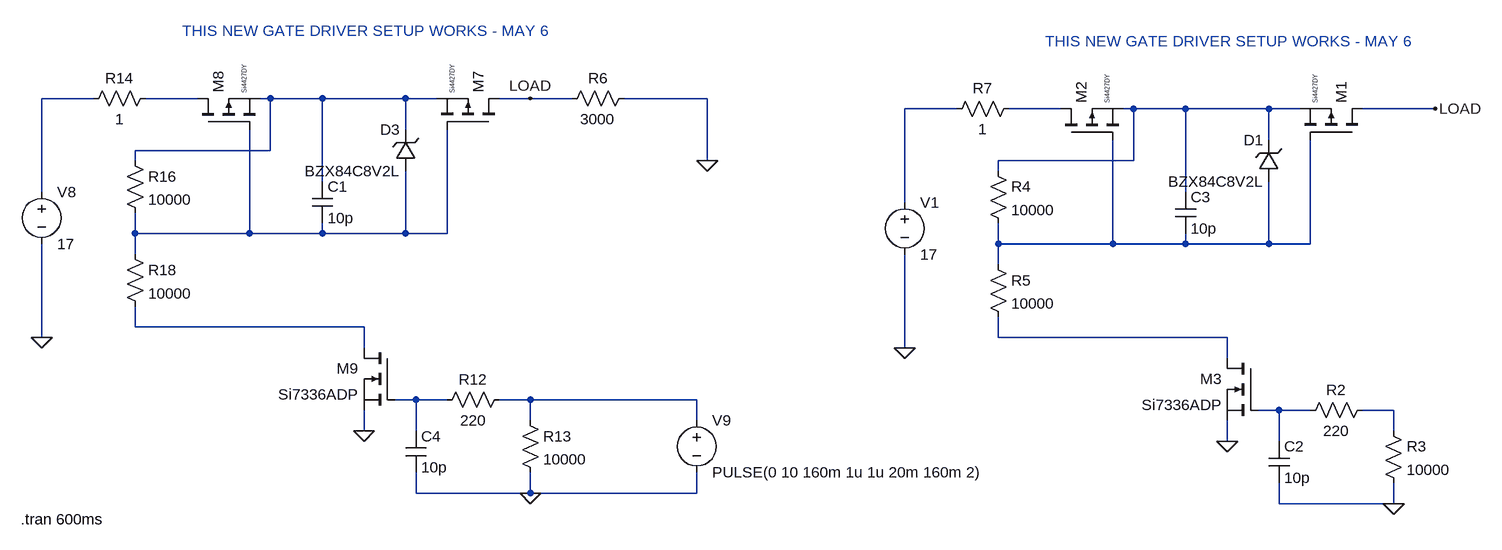
[diagram p0: schematic PMOS Bidirectional Switch OLD.asc]
PMOS Bidirectional Switch OLD.asc, the LTspice schematic file:
Version 4.1
SHEET 1 1960 2516
WIRE -768 400 -848 400
WIRE -608 400 -688 400
WIRE -496 400 -512 400
WIRE -416 400 -496 400
WIRE -288 400 -416 400
WIRE -240 400 -288 400
WIRE -96 400 -144 400
WIRE -32 400 -96 400
WIRE 176 400 48 400
WIRE 560 416 480 416
WIRE 720 416 640 416
WIRE 832 416 816 416
WIRE 912 416 832 416
WIRE 1040 416 912 416
WIRE 1088 416 1040 416
WIRE 1296 416 1184 416
WIRE -288 448 -288 400
WIRE 1040 464 1040 416
WIRE -496 480 -496 400
WIRE -496 480 -704 480
WIRE -704 496 -704 480
WIRE 176 496 176 400
WIRE 832 496 832 416
WIRE 832 496 624 496
WIRE 624 512 624 496
WIRE -416 528 -416 400
WIRE -848 544 -848 400
WIRE 912 544 912 416
WIRE 480 560 480 416
WIRE -704 608 -704 576
WIRE -528 608 -528 448
WIRE -528 608 -704 608
WIRE -416 608 -416 592
WIRE -416 608 -528 608
WIRE -288 608 -288 512
WIRE -288 608 -416 608
WIRE -224 608 -224 448
WIRE -224 608 -288 608
WIRE 624 624 624 592
WIRE 800 624 800 464
WIRE 800 624 624 624
WIRE 912 624 912 608
WIRE 912 624 800 624
WIRE 1040 624 1040 528
WIRE 1040 624 912 624
WIRE 1104 624 1104 464
WIRE 1104 624 1040 624
WIRE -704 640 -704 608
WIRE 624 656 624 624
WIRE -704 752 -704 720
WIRE -352 752 -704 752
WIRE -848 768 -848 624
WIRE 624 768 624 736
WIRE 976 768 624 768
WIRE -352 784 -352 752
WIRE 480 784 480 640
WIRE 976 800 976 768
WIRE -272 864 -304 864
WIRE -224 864 -272 864
WIRE -96 864 -144 864
WIRE 160 864 -96 864
WIRE 1056 880 1024 880
WIRE 1104 880 1056 880
WIRE 1232 880 1184 880
WIRE -96 896 -96 864
WIRE 160 896 160 864
WIRE -352 912 -352 880
WIRE -272 912 -272 864
WIRE 1232 912 1232 880
WIRE 976 928 976 896
WIRE 1056 928 1056 880
WIRE -272 1008 -272 976
WIRE -96 1008 -96 976
WIRE -96 1008 -272 1008
WIRE 160 1008 160 976
WIRE 160 1008 -96 1008
WIRE 1056 1024 1056 992
WIRE 1232 1024 1232 992
WIRE 1232 1024 1056 1024
FLAG 176 496 0
FLAG -848 768 0
FLAG -352 912 0
FLAG -96 1008 0
FLAG 480 784 0
FLAG 976 928 0
FLAG 1232 1024 0
FLAG 1296 416 LOAD
FLAG -96 400 LOAD
SYMBOL pmos -144 448 M270
WINDOW 3 56 72 Left 0
SYMATTR Value Si4427DY
SYMATTR InstName M7
SYMBOL pmos -608 448 R270
WINDOW 3 56 72 Left 0
SYMATTR Value Si4427DY
SYMATTR InstName M8
SYMBOL res 64 384 R90
WINDOW 0 0 56 VBottom 2
WINDOW 3 32 56 VTop 2
SYMATTR InstName R6
SYMATTR Value 3000
SYMBOL voltage -848 528 R0
WINDOW 123 0 0 Left 0
WINDOW 39 24 124 Left 2
SYMATTR InstName V8
SYMATTR Value 17
SYMBOL nmos -304 784 M0
SYMATTR InstName M9
SYMATTR Value Si7336ADP
SYMBOL voltage 160 880 R0
WINDOW 123 0 0 Left 0
WINDOW 39 0 0 Left 0
SYMATTR InstName V9
SYMATTR Value PULSE(0 10 160m 1u 1u 20m 160m 2)
SYMBOL res -128 848 R90
WINDOW 0 0 56 VBottom 2
WINDOW 3 32 56 VTop 2
SYMATTR InstName R12
SYMATTR Value 220
SYMBOL res -112 880 R0
SYMATTR InstName R13
SYMATTR Value 10000
SYMBOL cap -288 912 R0
SYMATTR InstName C4
SYMATTR Value 10p
SYMBOL res -720 480 R0
SYMATTR InstName R16
SYMATTR Value 10000
SYMBOL res -720 624 R0
SYMATTR InstName R18
SYMATTR Value 10000
SYMBOL zener -272 512 R180
WINDOW 0 24 64 Left 2
WINDOW 3 24 0 Left 2
SYMATTR InstName D3
SYMATTR Value BZX84C8V2L
SYMBOL res -672 384 R90
WINDOW 0 0 56 VBottom 2
WINDOW 3 32 56 VTop 2
SYMATTR InstName R14
SYMATTR Value 1
SYMBOL cap -432 528 R0
SYMATTR InstName C1
SYMATTR Value 10p
SYMBOL pmos 1184 464 M270
WINDOW 3 56 72 Left 0
SYMATTR Value Si4427DY
SYMATTR InstName M1
SYMBOL pmos 720 464 R270
WINDOW 3 56 72 Left 0
SYMATTR Value Si4427DY
SYMATTR InstName M2
SYMBOL voltage 480 544 R0
WINDOW 123 0 0 Left 0
WINDOW 39 24 124 Left 2
SYMATTR InstName V1
SYMATTR Value 17
SYMBOL nmos 1024 800 M0
SYMATTR InstName M3
SYMATTR Value Si7336ADP
SYMBOL res 1200 864 R90
WINDOW 0 0 56 VBottom 2
WINDOW 3 32 56 VTop 2
SYMATTR InstName R2
SYMATTR Value 220
SYMBOL res 1216 896 R0
SYMATTR InstName R3
SYMATTR Value 10000
SYMBOL cap 1040 928 R0
SYMATTR InstName C2
SYMATTR Value 10p
SYMBOL res 608 496 R0
SYMATTR InstName R4
SYMATTR Value 10000
SYMBOL res 608 640 R0
SYMATTR InstName R5
SYMATTR Value 10000
SYMBOL zener 1056 528 R180
WINDOW 0 24 64 Left 2
WINDOW 3 24 0 Left 2
SYMATTR InstName D1
SYMATTR Value BZX84C8V2L
SYMBOL res 656 400 R90
WINDOW 0 0 56 VBottom 2
WINDOW 3 32 56 VTop 2
SYMATTR InstName R7
SYMATTR Value 1
SYMBOL cap 896 544 R0
SYMATTR InstName C3
SYMATTR Value 10p
TEXT -632 296 Left 2 ;THIS NEW GATE DRIVER SETUP WORKS - MAY 6
TEXT 696 312 Left 2 ;THIS NEW GATE DRIVER SETUP WORKS - MAY 6
TEXT -880 1048 Left 2 !.tran 600ms

The netlist it stands for:
* PMOS Bidirectional Switch OLD.asc
M7 LOAD N007 N003 N003 Si4427DY
M8 N002 N007 N003 N003 Si4427DY
R6 0 LOAD 3000
V8 N001 0 17
M9 N009 N011 0 0 Si7336ADP
V9 N012 0 PULSE(0 10 160m 1u 1u 20m 160m 2)
R12 N012 N011 220
R13 N012 0 10000
C4 N011 0 10p
R16 N003 N007 10000
R18 N007 N009 10000
D3 N007 N003 BZX84C8V2L
R14 N002 N001 1
C1 N003 N007 10p
M1 LOAD N008 N006 N006 Si4427DY
M2 N005 N008 N006 N006 Si4427DY
V1 N004 0 17
M3 N010 N013 0 0 Si7336ADP
R2 N014 N013 220
R3 N014 0 10000
C2 N013 0 10p
R4 N006 N008 10000
R5 N008 N010 10000
D1 N008 N006 BZX84C8V2L
R7 N005 N004 1
C3 N006 N008 10p
.model D D
.lib standard.dio
.model NMOS NMOS
.model PMOS PMOS
.lib standard.mos
* THIS NEW GATE DRIVER SETUP WORKS - MAY 6
* THIS NEW GATE DRIVER SETUP WORKS - MAY 6
.tran 600ms
.backanno
.end